# EAGLE design mbhp_ainser64_v1 (EAGLE 6.5.0)
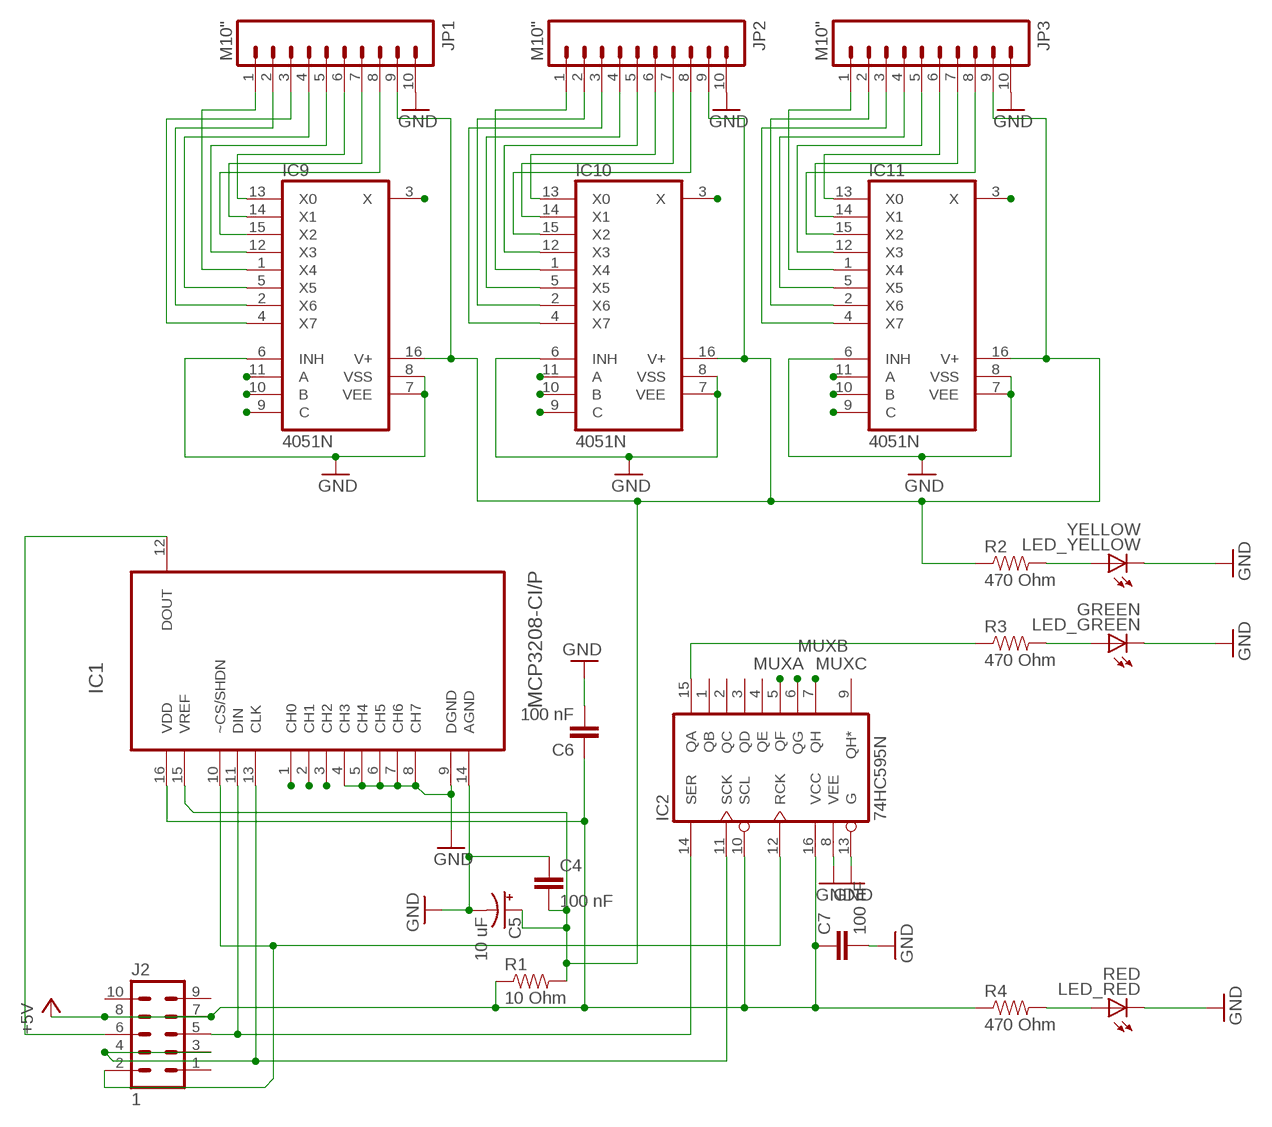
[diagram p0: schematic, sheet 1]

## Parts
C4  100 nF  CAPPTH1  [CAP-PTH-5MM]
C5  10 uF  10UF-25V-20%(PTH)  [CPOL-RADIAL-10UF-25V]
C6  100 nF  CAPPTH1  [CAP-PTH-5MM]
C7  100 nF  CAPPTH1  [CAP-PTH-5MM]
IC1  MCP3208-CI/P  [DIP254P762X432-16]
IC2  74HC595N  [DIL16]
IC9  4051N  [DIL16]
IC10  4051N  [DIL16]
IC11  4051N  [DIL16]
J2  1  MA05-2  [MA05-2]
JP1  M10"  [1X10]
JP2  M10"  [1X10]
JP3  M10"  [1X10]
LED_GREEN  GREEN  LED-3MM-NO_SILK  [LED3MM-NS]
LED_RED  RED  LED-3MM-NO_SILK  [LED3MM-NS]
LED_YELLOW  YELLOW  LED-3MM-NO_SILK  [LED3MM-NS]
R1  10 Ohm  RESISTORAXIAL-0.3  [AXIAL-0.3]
R2  470 Ohm  RESISTORAXIAL-0.3  [AXIAL-0.3]
R3  470 Ohm  RESISTORAXIAL-0.3  [AXIAL-0.3]
R4  470 Ohm  RESISTORAXIAL-0.3  [AXIAL-0.3]

## Nets
+5V: C6.1 C7.1 IC1.16(VDD) IC2.10(SCL) IC2.16(VCC) J2.7 J2.8 R1.P$1 R4.P$1
CH0: IC1.1(CH0) IC11.3(X)
CH1: IC1.2(CH1) IC10.3(X)
CH2: IC1.3(CH2) IC9.3(X)
GND: C4.1 C5.2(-) C6.2 C7.2 IC1.4(CH3) IC1.5(CH4) IC1.6(CH5) IC1.7(CH6) IC1.8(CH7) IC1.9(DGND) IC1.14(AGND) IC2.8(VEE) IC2.13(G) IC9.6(INH) IC9.7(VEE) IC9.8(VSS) IC10.6(INH) IC10.7(VEE) IC10.8(VSS) IC11.6(INH) IC11.7(VEE) IC11.8(VSS) JP1.10 JP2.10 JP3.10 LED_GREEN.K(C) LED_RED.K(C) LED_YELLOW.K(C)
MUXA: IC2.5(QF) IC9.9(C) IC10.9(C) IC11.9(C)
MUXB: IC2.6(QG) IC9.10(B) IC10.10(B) IC11.10(B)
MUXC: IC2.7(QH) IC9.11(A) IC10.11(A) IC11.11(A)
N$1: IC1.10(~CS/SHDN) IC2.12(RCK) J2.2
N$2: IC1.13(CLK) IC2.11(SCK) J2.3 J2.4
N$3: IC1.11(DIN) IC2.14(SER) J2.5
N$4: LED_RED.A R4.P$2
N$5: IC1.12(DOUT) J2.6
N$6: C4.2 C5.1(+) IC1.15(VREF) IC9.16(V+) IC10.16(V+) IC11.16(V+) JP1.9 JP2.9 JP3.9 R1.P$2 R2.P$1
N$7: LED_GREEN.A R3.P$2
N$8: IC2.15(QA) R3.P$1
N$9: IC10.13(X0) JP2.6
N$10: IC10.14(X1) JP2.7
N$11: IC10.15(X2) JP2.8
N$12: IC10.12(X3) JP2.5
N$13: IC10.5(X5) JP2.4
N$14: IC10.4(X7) JP2.3
N$15: IC10.2(X6) JP2.2
N$16: IC10.1(X4) JP2.1
N$17: IC11.15(X2) JP3.8
N$18: IC11.14(X1) JP3.7
N$19: IC11.13(X0) JP3.6
N$20: IC11.12(X3) JP3.5
N$21: IC11.5(X5) JP3.4
N$22: IC11.4(X7) JP3.3
N$23: IC11.2(X6) JP3.2
N$24: IC11.1(X4) JP3.1
N$25: IC9.15(X2) JP1.8
N$26: IC9.14(X1) JP1.7
N$27: IC9.13(X0) JP1.6
N$28: IC9.12(X3) JP1.5
N$29: IC9.5(X5) JP1.4
N$30: IC9.4(X7) JP1.3
N$31: IC9.2(X6) JP1.2
N$32: IC9.1(X4) JP1.1
N$33: LED_YELLOW.A R2.P$2
Unconnected: IC2.1(QB) IC2.2(QC) IC2.3(QD) IC2.4(QE) IC2.9(QH*) J2.1 J2.9 J2.10

## Library data of the parts
C4 C6 C7 = SparkFun-Capacitors:CAP: Capacitor Standard 0603 ceramic capacitor, and 0.1" leaded capacitor.
C5 = SparkFun-Capacitors:10UF-25V-20%(PTH): CAP-08440; PROD_ID: CAP-08440
IC1 = Microchip_By_element14_Batch_1:MCP3208-CI/P: A/D Converters; MPN: MCP3208-CI/P; OC_FARNELL: 1084269; OC_NEWARK: 58K1815; PACKAGE: DIP-16; SUPPLIER: Microchip
IC2 = 74xx-eu:74*595: 8-bit SHIFT REGISTER, output latch
IC9-IC11 = 40xx:4051: 8-channel ANALOG MULTIPLEXER
J2 = con-lstb:MA05-2: PIN HEADER; OC_FARNELL: unknown; OC_NEWARK: unknown
JP1-JP3 = SparkFun-Connectors:M10: Header 10 Standard 10-pin 0.1" header. Use with straight break away headers (SKU : PRT-00116), right angle break away headers (PRT-00553), swiss pins (PRT-00743), machine pins (PRT-00117), and female headers (PRT-00115).
LED_GREEN LED_RED LED_YELLOW = SparkFun-LED:LED: LEDs Standard schematic elements and footprints for 5mm, 3mm, 1206, and 0603 sized LEDs. 5mm - Spark Fun Electronics SKU : COM-00529 (and others)
R1-R4 = SparkFun-Resistors:RESISTOR: Resistor Basic schematic elements and footprints for 0603, 1206, and PTH resistors.

## Board
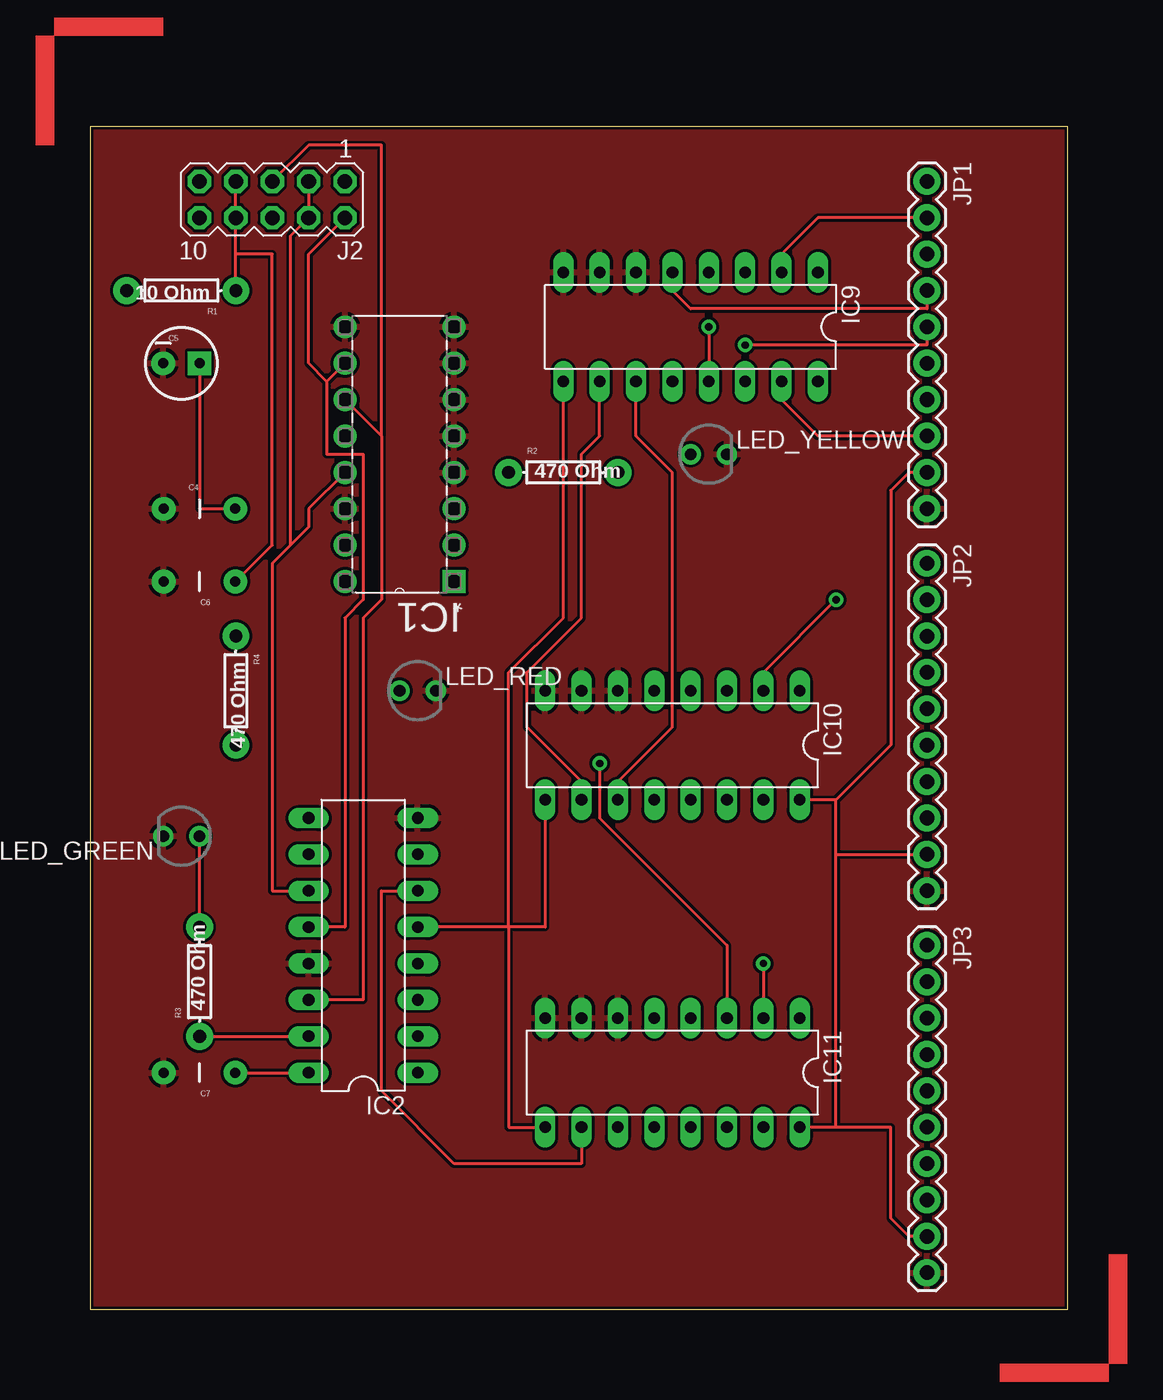
[diagram p1: board, top side]
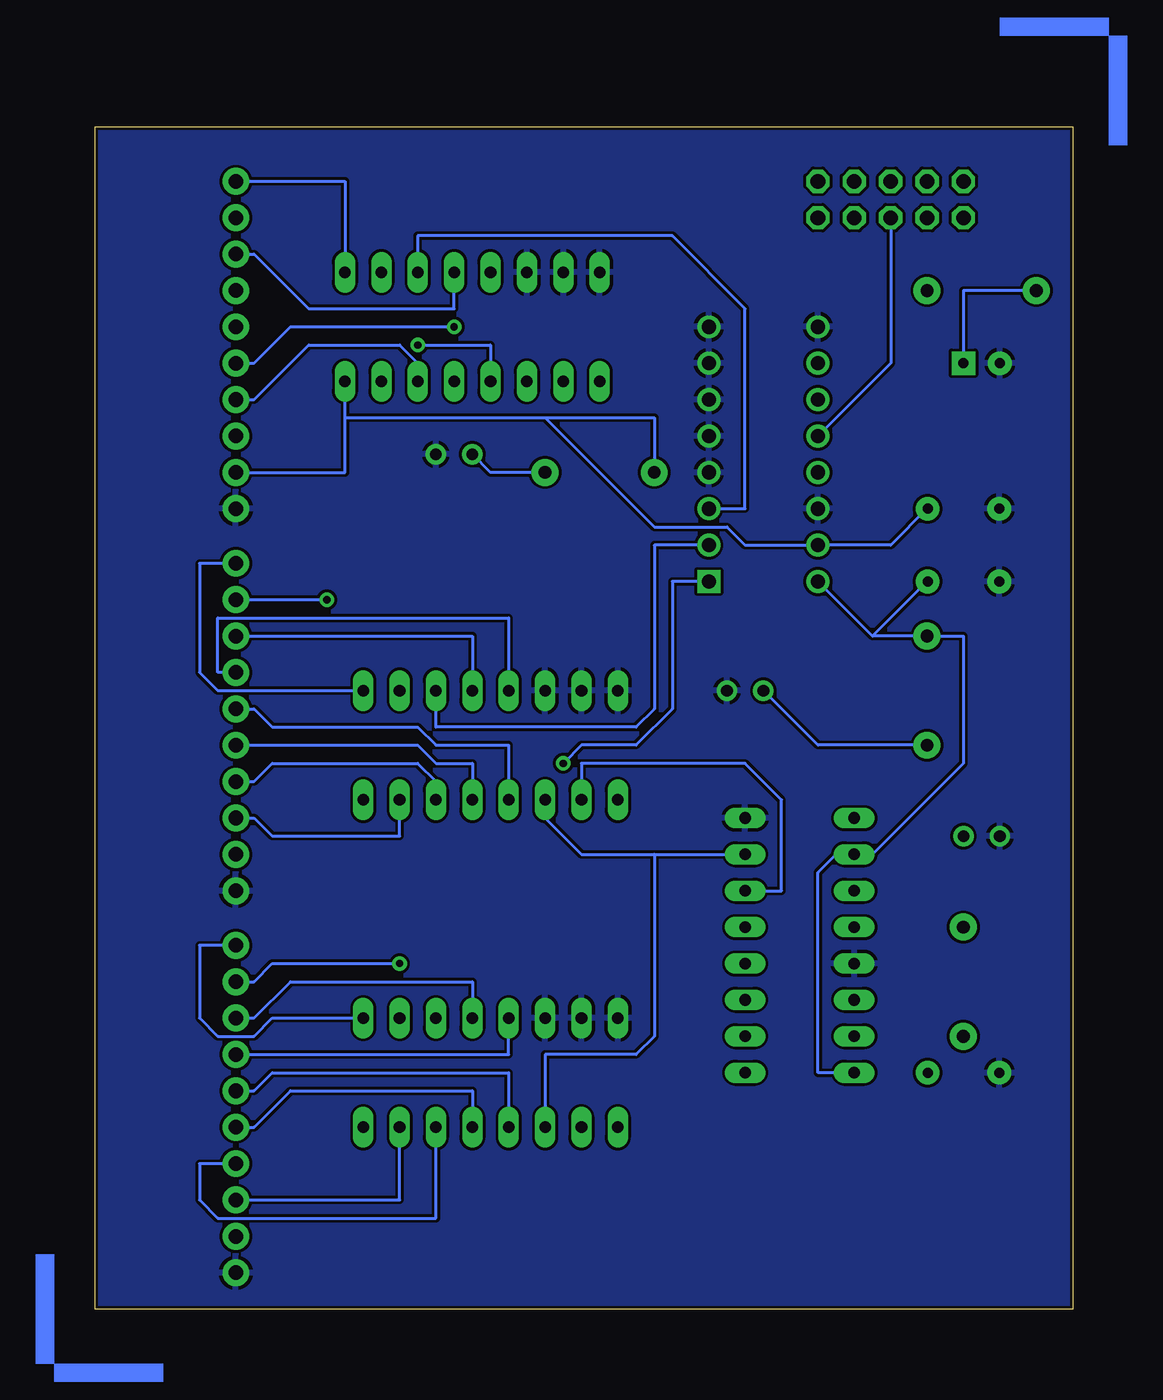
[diagram p2: board, bottom side, seen from below]

Size 68.25 x 82.54 mm. Coordinates in mm from the lower left corner, seen from the top.
Outline: 0,0 68.25,0 68.25,82.54 0,82.54 0,0
Copper layers (1*16): Top 0.035mm / dielectric 1.5mm / Bottom 0.035mm
Design rules "SparkFun": minimum track width 8mil, minimum drill 20mil, track to track 8mil, track to pad 8mil, pad to pad 8mil, via to via 8mil, smd to smd 8mil, copper to edge 8mil, drill to drill 8mil, minimum pad ring 12mil, minimum via ring 10mil, stop-mask expansion 4mil, vias tented up to drill 20mil, thermal gap 10mil

### Footprints (pad centres in the part's own frame; a part is rotated, then mirrored left to right if it is on the bottom)
CAP-PTH-5MM = drill 0.7 pad 1.651: 1 -2.5,0; 2 2.5,0
CPOL-RADIAL-10UF-25V = drill 0.7 pad 1.651 square: 1 1.27,0 | drill 0.7 pad 1.651: 2 -1.27,0
DIP254P762X432-16 = drill 0.991 square: 1 -7.62,17.78 | drill 0.991: 2 -7.62,15.24; 3 -7.62,12.7; 4 -7.62,10.16; 5 -7.62,7.62; 6 -7.62,5.08; 7 -7.62,2.54; 8 -7.62,0; 9 0,0; 10 0,2.54; 11 0,5.08; 12 0,7.62; 13 0,10.16; 14 0,12.7; 15 0,15.24; 16 0,17.78
DIL16 = drill 0.813 long: 1 -8.89,-3.81; 2 -6.35,-3.81; 3 -3.81,-3.81; 4 -1.27,-3.81; 5 1.27,-3.81; 6 3.81,-3.81; 7 6.35,-3.81; 8 8.89,-3.81; 9 8.89,3.81; 10 6.35,3.81; 11 3.81,3.81; 12 1.27,3.81; 13 -1.27,3.81; 14 -3.81,3.81; 15 -6.35,3.81; 16 -8.89,3.81
MA05-2 = drill 1.016 octagon: 1 -5.08,-1.27; 2 -5.08,1.27; 3 -2.54,-1.27; 4 -2.54,1.27; 5 0,-1.27; 6 0,1.27; 7 2.54,-1.27; 8 2.54,1.27; 9 5.08,-1.27; 10 5.08,1.27
1X10 = drill 1.016 pad 1.88: 1 0,0; 2 2.54,0; 3 5.08,0; 4 7.62,0; 5 10.16,0; 6 12.7,0; 7 15.24,0; 8 17.78,0; 9 20.32,0; 10 22.86,0
LED3MM-NS = drill 0.813: A -1.27,0; K 1.27,0
AXIAL-0.3 = drill 0.9 pad 1.88: P$1 -3.81,0; P$2 3.81,0

### Placement (x,y rotation side)
C4  7.62,55.88 0 top
C5  6.35,66.04 0 top
C6  7.62,50.8 180 top
C7  7.62,16.51 180 top
IC1  17.78,68.58 180 top
IC2  19.05,25.4 90 top
IC9  41.91,68.58 180 top
IC10  40.64,39.37 180 top
IC11  40.64,16.51 180 top
J2  12.7,77.47 180 top
JP1  58.42,78.74 270 top
JP2  58.42,52.07 270 top
JP3  58.42,25.4 270 top
LED_GREEN  6.35,33.02 180 top
LED_RED  22.86,43.18 0 top
LED_YELLOW  43.18,59.69 0 top
R1  6.35,71.12 180 top
R2  33.02,58.42 0 top
R3  7.62,22.86 90 top
R4  10.16,43.18 270 top
U$1  [ANGLE-ARROW-NW1]  -2.54,88.9 0 top  (outside the outline)
U$2  [ANGLE-ARROW-NW1]  71.12,-3.81 180 top  (outside the outline)
U$3  [ANGLE-ARROW-NW1-16]  -2.54,88.9 0 top  (outside the outline)
U$4  [ANGLE-ARROW-NW1-16]  71.12,-3.81 180 top  (outside the outline)

### Tracks (layer width: path | path; a pad name or v marks a point on that pad's centre or on a via)
+5V
  Top 0.203: C7.1 IC2.16 | R1.P$1 10.16,73.66 | 10.16,73.66 J2.8 J2.7 | 10.16,73.66 12.7,73.66 12.7,53.34 10.16,50.8 C6.1
  Bottom 0.203: IC2.16 17.78,16.51 17.78,30.48 16.51,31.75 IC2.10 13.97,31.75 7.62,38.1 7.62,46.99 R4.P$1 13.97,46.99 | 13.97,46.99 IC1.16 | 13.97,46.99 10.16,50.8 C6.1
CH0  (via drill 0.51)
  Top 0.203: IC11.3 44.45,25.4 35.56,34.29 v35.56,38.1
  Bottom 0.203: v35.56,38.1 34.29,39.37 30.48,39.37 27.94,41.91 27.94,50.8 IC1.1
CH1
  Bottom 0.203: IC10.3 44.45,40.64 30.48,40.64 29.21,41.91 29.21,53.34 IC1.2
CH2
  Bottom 0.203: IC9.3 45.72,74.93 27.94,74.93 22.86,69.85 22.86,55.88 IC1.3
GND
  pour Bottom: 0,82.55 68.58,82.55 68.58,0 0,0
  pour Top: 0,82.55 68.58,82.55 68.58,0 0,0
MUXA
  Top 0.203: 29.21,26.67 31.75,26.67 IC10.9 | 29.21,26.67 IC2.5 | IC11.9 29.21,12.7 29.21,26.67 | IC9.9 33.02,48.26 29.21,44.45 29.21,26.67
MUXB
  Top 0.203: IC2.6 20.32,29.21 20.32,15.24 25.4,10.16 34.29,10.16 IC11.10 | IC9.10 35.56,60.96 34.29,59.69 34.29,48.26 30.48,44.45 30.48,40.64 34.29,36.83 IC10.10
  Bottom 0.203: IC10.10 34.29,38.1 22.86,38.1 20.32,35.56 20.32,29.21 IC2.6
MUXC
  Top 0.203: IC9.11 38.1,60.96 40.64,58.42 40.64,40.64 36.83,36.83 IC10.11
  Bottom 0.203: 29.21,31.75 34.29,31.75 36.83,34.29 IC10.11 | 29.21,31.75 IC2.7 | IC11.11 36.83,17.78 30.48,17.78 29.21,19.05 29.21,31.75
N$1
  Top 0.203: IC2.12 17.78,26.67 17.78,48.26 19.05,49.53 19.05,59.69 16.51,59.69 16.51,64.77 | IC1.10 16.51,64.77 | J2.2 15.24,73.66 15.24,66.04 16.51,64.77
N$2
  Top 0.203: J2.3 J2.4 13.97,74.93 13.97,53.34 | IC2.11 12.7,29.21 12.7,52.07 13.97,53.34 | 13.97,53.34 15.24,54.61 15.24,55.88 IC1.13
N$3
  Top 0.203: IC2.14 19.05,21.59 19.05,48.26 20.32,49.53 20.32,60.96 | IC1.11 20.32,60.96 | J2.5 15.24,81.28 20.32,81.28 20.32,60.96
N$4
  Bottom 0.203: LED_RED.A 17.78,39.37 R4.P$2
N$5
  Bottom 0.203: IC1.12 12.7,66.04 J2.6
N$6
  Top 0.203: 52.07,12.7 55.88,12.7 55.88,6.35 57.15,5.08 JP3.9 | 52.07,12.7 IC11.16 | 52.07,35.56 IC10.16 | 52.07,12.7 52.07,31.75 | 52.07,31.75 52.07,35.56 | 52.07,31.75 JP2.9 | C5.1 7.62,55.88 C4.2 10.16,55.88 | 52.07,35.56 55.88,39.37 55.88,57.15 57.15,58.42 JP1.9
  Bottom 0.203: C4.2 10.16,55.88 12.7,53.34 IC1.15 22.86,53.34 24.13,54.61 29.21,54.61 36.83,62.23 | C5.1 7.62,71.12 R1.P$2 | 50.8,62.23 50.8,58.42 JP1.9 | 50.8,62.23 IC9.16 | R2.P$1 29.21,62.23 36.83,62.23 | 50.8,62.23 36.83,62.23
N$7
  Top 0.203: R3.P$2 LED_GREEN.A
N$8
  Top 0.203: R3.P$1 IC2.15
N$9
  Bottom 0.203: IC10.13 41.91,38.1 44.45,38.1 45.72,39.37 JP2.6
N$10
  Bottom 0.203: IC10.14 44.45,36.83 45.72,38.1 55.88,38.1 57.15,36.83 JP2.7
N$11
  Bottom 0.203: IC10.15 46.99,33.02 55.88,33.02 57.15,34.29 JP2.8
N$12
  Bottom 0.203: IC10.12 39.37,39.37 44.45,39.37 45.72,40.64 55.88,40.64 57.15,41.91 JP2.5
N$13
  Bottom 0.203: IC10.5 39.37,48.26 59.69,48.26 59.69,44.45 JP2.4
N$14
  Bottom 0.203: IC10.4 41.91,46.99 JP2.3
N$15  (via drill 0.51)
  Top 0.203: IC10.2 46.99,44.45 v52.07,49.53
  Bottom 0.203: JP2.2 v52.07,49.53
N$16
  Bottom 0.203: IC10.1 59.69,43.18 60.96,44.45 60.96,52.07 JP2.1
N$17
  Bottom 0.203: IC11.15 46.99,7.62 JP3.8
N$18
  Bottom 0.203: IC11.14 44.45,6.35 59.69,6.35 60.96,7.62 60.96,10.16 JP3.7
N$19
  Bottom 0.203: IC11.13 41.91,15.24 54.61,15.24 57.15,12.7 JP3.6
N$20
  Bottom 0.203: IC11.12 39.37,16.51 55.88,16.51 57.15,15.24 JP3.5
N$21
  Bottom 0.203: IC11.5 39.37,17.78 JP3.4
N$22
  Bottom 0.203: IC11.4 41.91,22.86 54.61,22.86 57.15,20.32 JP3.3
N$23  (via drill 0.51)
  Top 0.203: v46.99,24.13 IC11.2
  Bottom 0.203: v46.99,24.13 55.88,24.13 57.15,22.86 JP3.2
N$24
  Bottom 0.203: IC11.1 55.88,20.32 57.15,19.05 59.69,19.05 60.96,20.32 60.96,25.4 JP3.1
N$25
  Top 0.203: IC9.15 48.26,63.5 50.8,60.96 JP1.8
N$26
  Bottom 0.203: IC9.14 45.72,66.04 46.99,67.31 53.34,67.31 57.15,63.5 JP1.7
N$27  (via drill 0.51)
  Top 0.203: v43.18,68.58 IC9.13
  Bottom 0.203: v43.18,68.58 54.61,68.58 57.15,66.04 JP1.6
N$28  (via drill 0.51)
  Top 0.203: v45.72,67.31 58.42,67.31 JP1.5
  Bottom 0.203: IC9.12 40.64,67.31 v45.72,67.31
N$29
  Top 0.203: IC9.5 40.64,71.12 41.91,69.85 58.42,69.85 JP1.4
N$30
  Bottom 0.203: IC9.4 43.18,69.85 53.34,69.85 57.15,73.66 JP1.3
N$31
  Top 0.203: IC9.2 48.26,73.66 50.8,76.2 JP1.2
N$32
  Bottom 0.203: IC9.1 50.8,78.74 JP1.1
N$33
  Bottom 0.203: LED_YELLOW.A 40.64,58.42 R2.P$2